# EAGLE board kulgurpower2-unrouted (EAGLE 6.3)
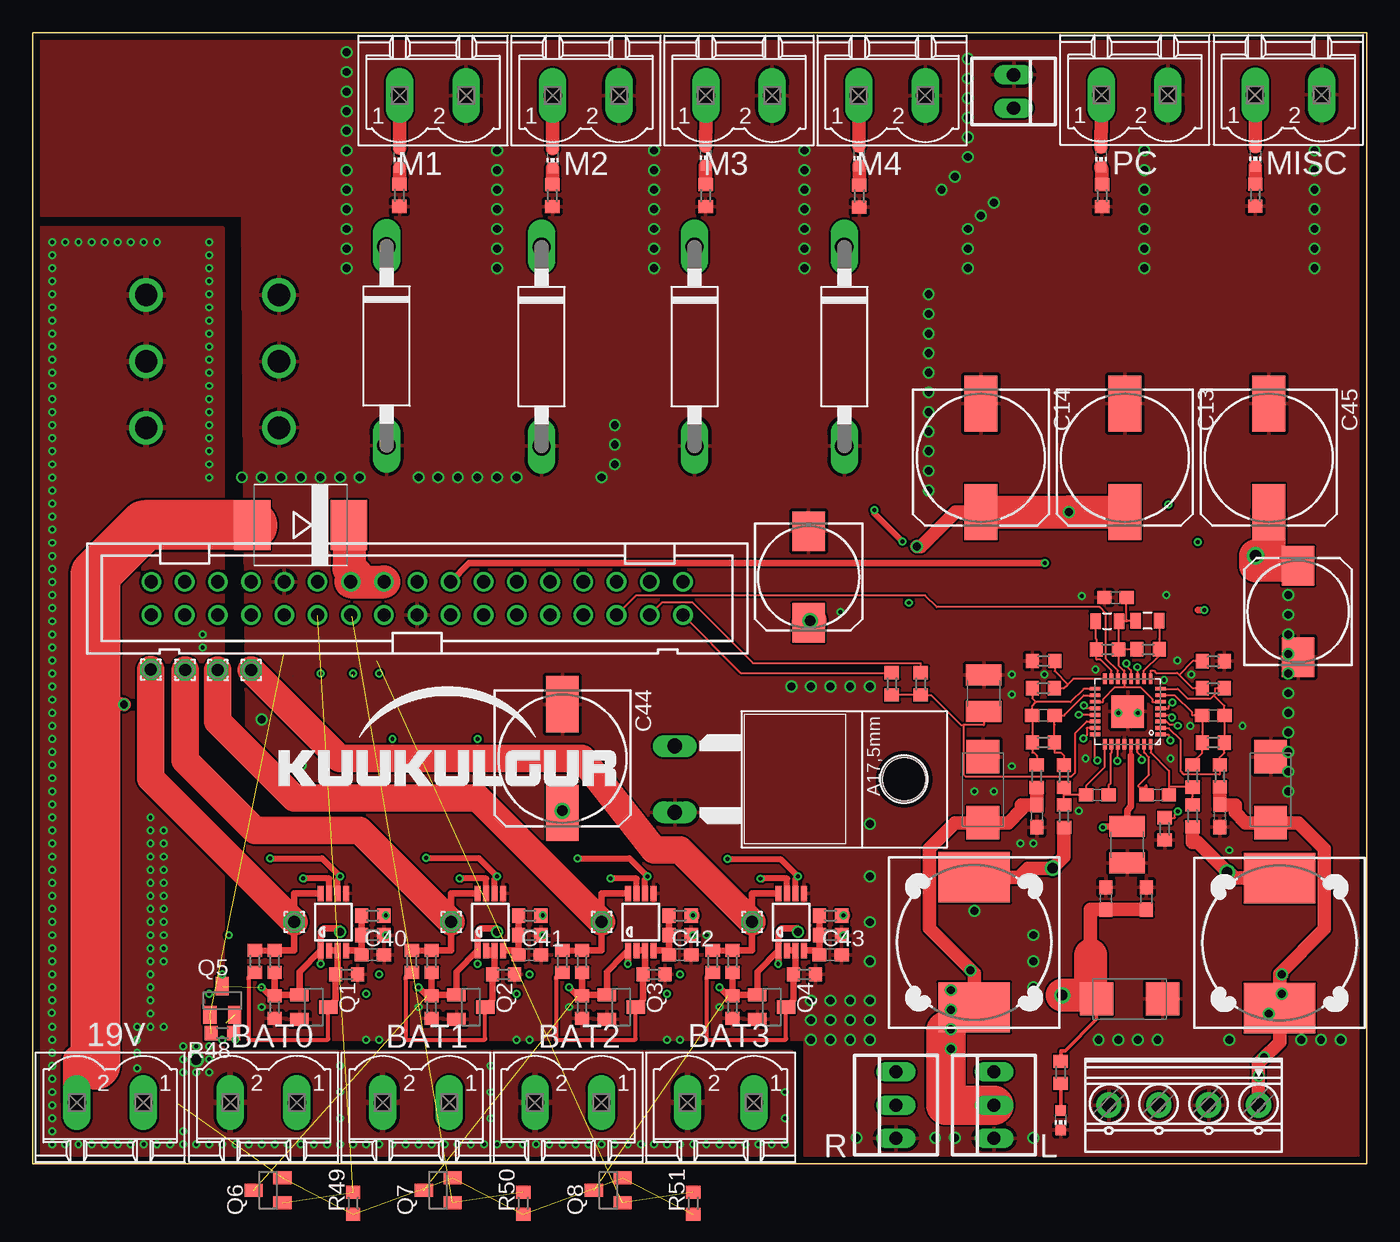
[diagram p6: board, top side]
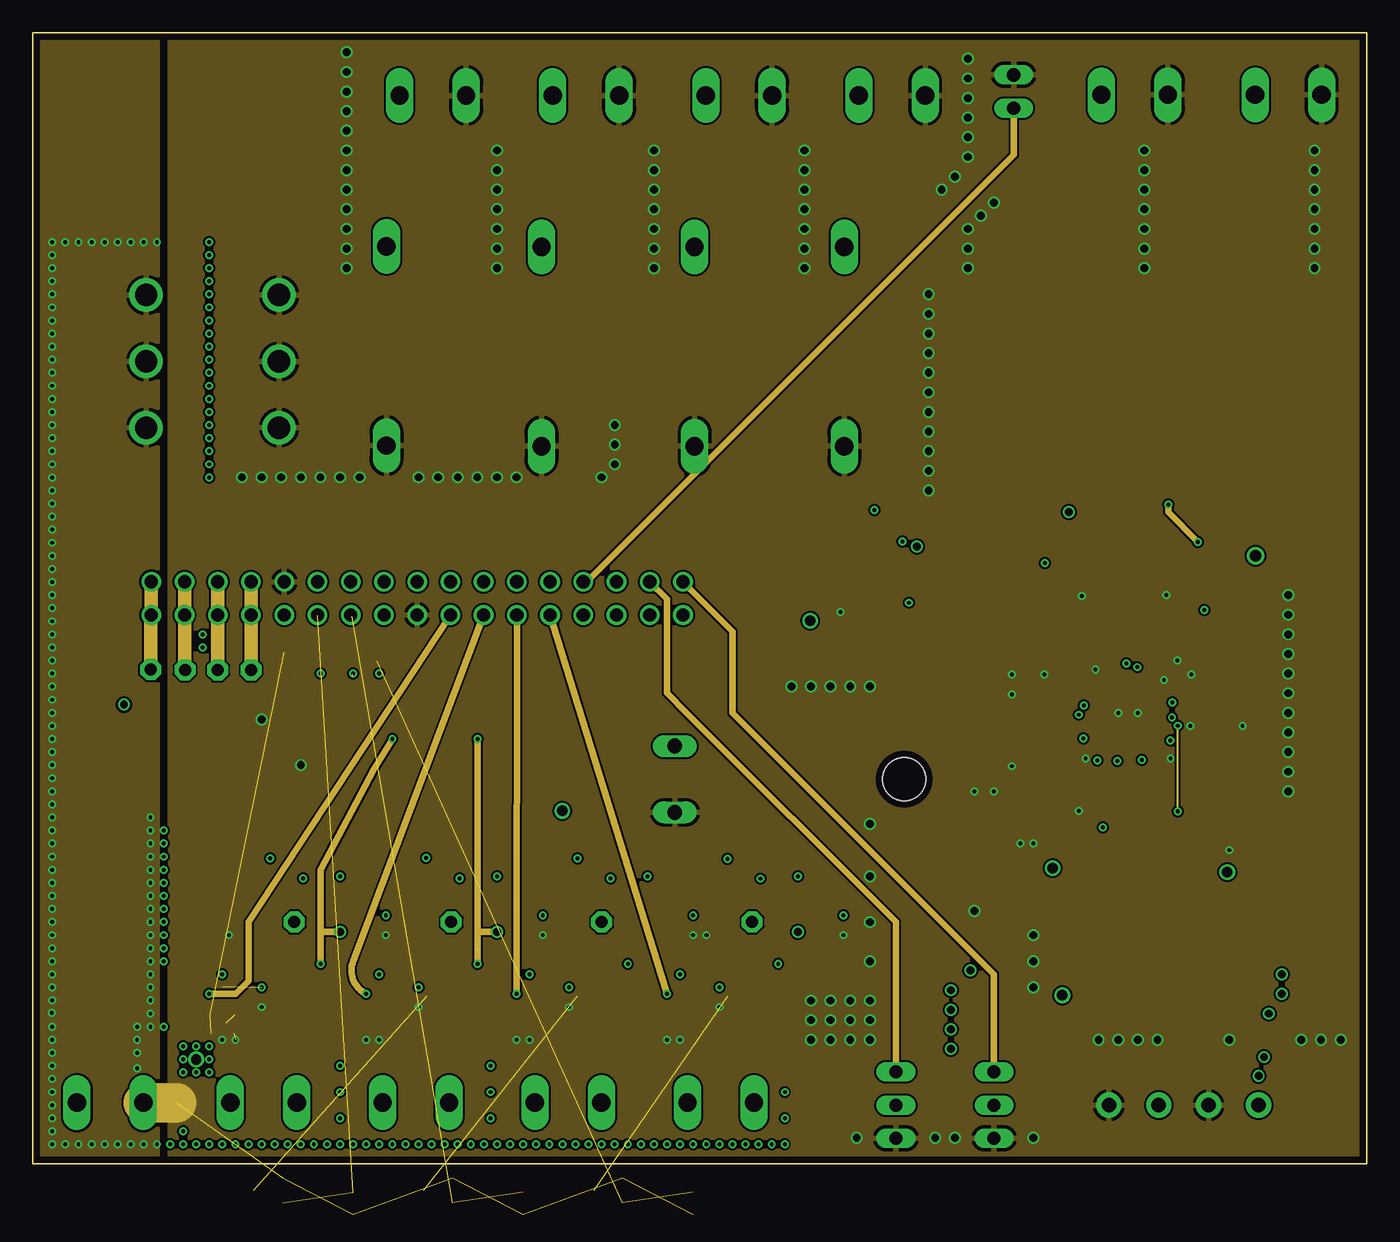
[diagram p7: board, inner layer Route2]
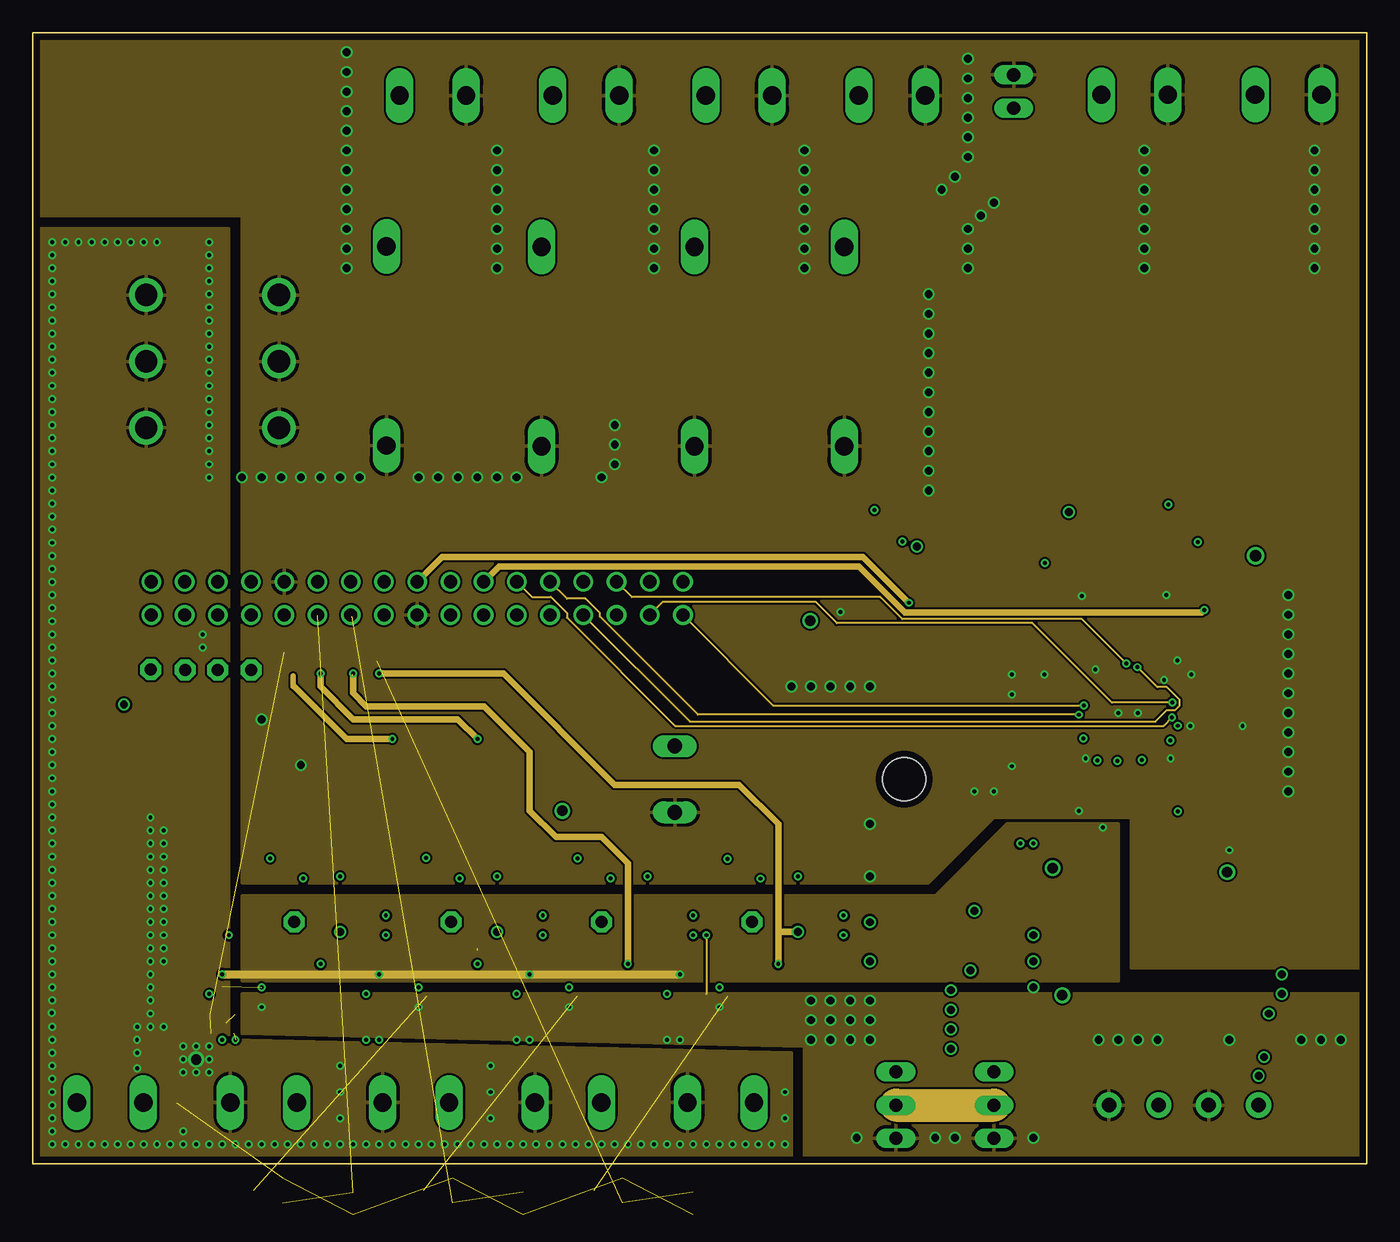
[diagram p8: board, inner layer Route15]
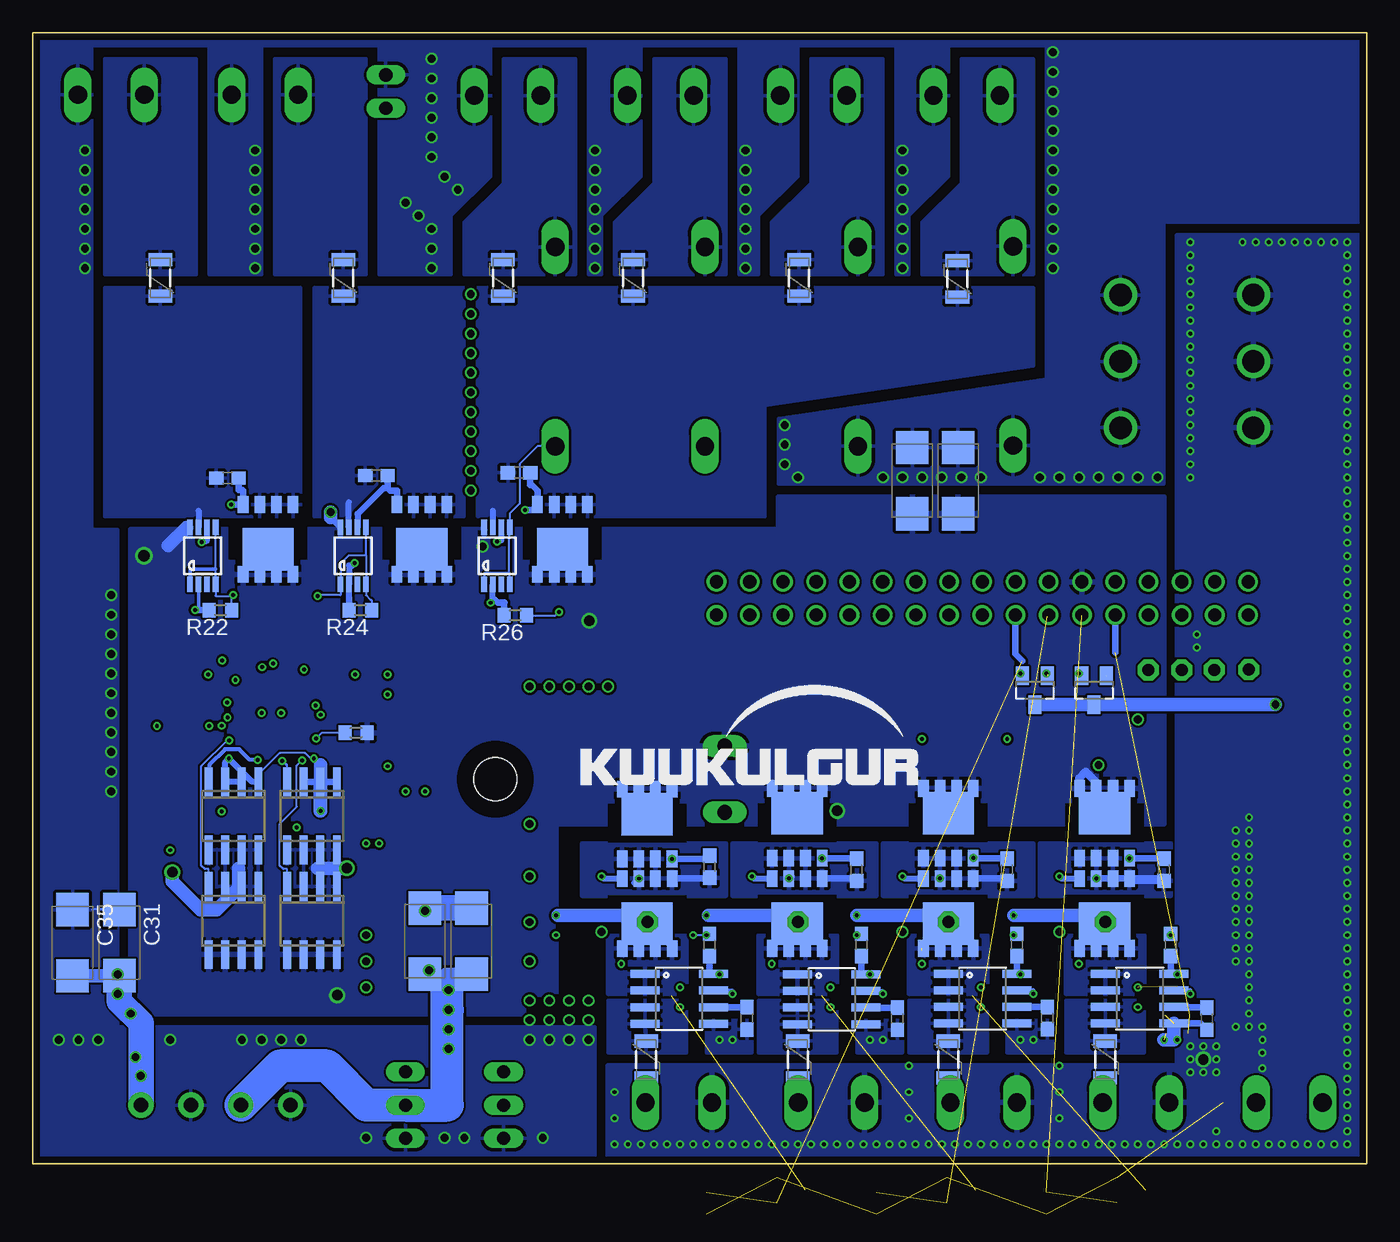
[diagram p9: board, bottom side, seen from below]

Size 102 x 86.5 mm. Coordinates in mm from the lower left corner, seen from the top.
Outline: 102,86.5 0,86.5 0,0 102,0
Outline: 102,86.5 102,0
Outline: 102,86.5 102,0
Copper layers (1*2+15*16): Top 0.035mm / dielectric 0.6mm / Route2 0.035mm / dielectric 0.15mm / Route15 0.035mm / dielectric 0.6mm / Bottom 0.035mm
Design rules "4mil_4lay2 *": minimum track width 6mil, minimum drill 0.299mm, track to track 5mil, track to pad 5mil, pad to pad 5mil, via to via 5mil, smd to smd 0mil, copper to edge 20mil, drill to drill 8mil, minimum pad ring 8mil, minimum via ring 6mil, stop-mask expansion 4mil, vias tented up to drill 18mil, thermal gap 10mil
Net classes: 0 default: width 0.152 mm, drill 0.3 mm, clearance 0.152 mm; 1 power: width 0.508 mm, drill 0.6 mm, clearance 0.178 mm; 2 morepower: width 1.016 mm, drill 0.6 mm, clearance 0.178 mm; 3 gnd: width 0.305 mm, drill 0.3 mm, clearance 0.178 mm

## Footprints (pad centres in the part's own frame; a part is rotated, then mirrored left to right if it is on the bottom)
MSTBV2 = drill 1.397 long: 1 -2.54,0; 2 2.54,0
C/6032-28R = smd 2.55 x 2.5: + 2.525,0; - -2.525,0
C0603 = smd 1.1 x 1: 1 -0.85,0; 2 0.85,0
C1210 = smd 1.6 x 2.7: 1 -1.4,0; 2 1.4,0
153CLV-1014 = smd 4.3 x 2.5: + 4.15,0; - -4.15,0
0805 = smd 0.8 x 1.2: 1 -0.9,0; 2 0.9,0
175TMP-0810 = smd 3 x 2.5: + 3.5,0; - -3.5,0
SOT23 = smd 1 x 1.4: 1 -0.95,-1.1; 2 0.95,-1.1; 3 0,1.1
C1702-15 = drill 1.397 long: A 7.62,0; C -7.62,0
SMC = smd 2.8 x 3.8: A 3.7,0; C -3.7,0
C221B1A = drill 1.118 long: A 2.54,-6.35; C -2.54,-6.35 | hole 3.302: 0,11.176
PTC-1206 = smd 1 x 1.8: 1 -1.4,0; 2 1.4,0
DR125 = smd 3.85 x 5.5: 1 -4.975,0; 2 4.975,0
CHIP-LED0603 = smd 0.8 x 0.8: A 0,-0.75; C 0,0.75
1,6/0,9 = drill 0.914 pad 1.6 octagon: 1 0,0
R0603 = smd 1 x 1.1: 1 -0.85,0; 2 0.85,0
POWER56 = smd 0.81 x 1.27: P$1 -1.905,-2.67; P$2 -0.635,-2.67; P$3 0.635,-2.67; P$4 1.905,-2.67; P$5 1.905,2.67; P$6 0.635,2.67; P$7 -0.635,2.67; P$8 -1.905,2.67 | smd 3.91 x 3.25: P$9 0,0.762
SO08 = smd 0.61 x 2.21: 1 -1.905,-2.616; 2 -0.635,-2.616; 3 0.635,-2.616; 4 1.905,-2.616; 5 1.905,2.616; 6 0.635,2.616; 7 -0.635,2.616; 8 -1.905,2.616
QFN-32 = smd 0.285 x 0.8: P$1 -1.75,-2.5; P$2 -1.25,-2.5; P$3 -0.75,-2.5; P$4 -0.25,-2.5; P$5 0.25,-2.5; P$6 0.75,-2.5; P$7 1.25,-2.5; P$8 1.75,-2.5; P$17 1.75,2.5; P$18 1.25,2.5; P$19 0.75,2.5; P$20 0.25,2.5; P$21 -0.25,2.5; P$22 -0.75,2.5; P$23 -1.25,2.5; P$24 -1.75,2.5 | smd 0.8 x 0.285: P$9 2.5,-1.75; P$10 2.5,-1.25; P$11 2.5,-0.75; P$12 2.5,-0.25; P$13 2.5,0.25; P$14 2.5,0.75; P$15 2.5,1.25; P$16 2.5,1.75; P$25 -2.5,1.75; P$26 -2.5,1.25; P$27 -2.5,0.75; P$28 -2.5,0.25; P$29 -2.5,-0.25; P$30 -2.5,-0.75; P$31 -2.5,-1.25; P$32 -2.5,-1.75 | smd 2.5 x 2.5: P$33 0,0
MAX1614EUA = smd 0.45 x 1.2: 1 -0.975,-2.175; 2 -0.325,-2.175; 3 0.325,-2.175; 4 0.975,-2.175; 5 0.975,2.175; 6 0.325,2.175; 7 -0.325,2.175; 8 -0.975,2.175
PC-6-16/2-G-10.16 = drill 1.7: P$1 -5.08,0; P$2 -5.08,-5.08; P$3 -5.08,-10.16; P$4 5.08,0; P$5 5.08,-5.08; P$6 5.08,-10.16
SO8 = smd 0.6 x 2.2: 1 -1.905,-2.6; 2 -0.635,-2.6; 3 0.635,-2.6; 4 1.905,-2.6; 5 1.905,2.6; 6 0.635,2.6; 7 -0.635,2.6; 8 -1.905,2.6
1727036 = drill 1.1 pad 1.93: 1 -5.715,0; 2 -1.905,0; 3 1.905,0; 4 5.715,0
PAK100/2500-34 = drill 1 pad 1.422: 1 -20.32,-1.27; 2 -20.32,1.27; 3 -17.78,-1.27; 4 -17.78,1.27; 5 -15.24,-1.27; 6 -15.24,1.27; 7 -12.7,-1.27; 8 -12.7,1.27; 9 -10.16,-1.27; 10 -10.16,1.27; 11 -7.62,-1.27; 12 -7.62,1.27; 13 -5.08,-1.27; 14 -5.08,1.27; 15 -2.54,-1.27; 16 -2.54,1.27; 17 0,-1.27; 18 0,1.27; 19 2.54,-1.27; 20 2.54,1.27; 21 5.08,-1.27; 22 5.08,1.27; 23 7.62,-1.27; 24 7.62,1.27; 25 10.16,-1.27; 26 10.16,1.27; 27 12.7,-1.27; 28 12.7,1.27; 29 15.24,-1.27; 30 15.24,1.27; 31 17.78,-1.27; 32 17.78,1.27; 33 20.32,-1.27; 34 20.32,1.27
22-23-2031 = drill 1 long: 1 -2.54,0; 2 0,0; 3 2.54,0
22-23-2021 = drill 1 long: 1 -1.27,0; 2 1.27,0

## Placement (x,y rotation side)
19V  MST2V  [MSTBV2]  5.92,4.69 180 top
BAT0  MST2V  [MSTBV2]  17.65,4.71 180 top
BAT1  MST2V  [MSTBV2]  29.3,4.7 180 top
BAT2  MST2V  [MSTBV2]  40.94,4.7 180 top
BAT3  MST2V  [MSTBV2]  52.6,4.7 180 top
C1  [C/6032-28R]  94.65,28.62 270 top
C2  [C/6032-28R]  72.65,28.62 270 top
C3  15V  [C/6032-28R]  83.86,12.62 180 top
C4  0.1  [C0603]  35.9,11.11 90 bottom
C5  10u  [C1210]  83.67,24.42 90 top
C6  0.1  [C0603]  39,22.5 90 bottom
C7  0.1  [C0603]  47.4,11.14 90 bottom
C8  0,1u  [C0603]  86.02,28.2 0 top
C9  0.1  [C0603]  50.24,22.73 90 bottom
C10  220n  [C0603]  82.78,43.3 180 top
C11  0.1  [C0603]  24.43,11.15 90 bottom
C12  0.1  [C0603]  27.5,22.5 90 bottom
C13  820uF/25V  [153CLV-1014]  83.5,54 270 top
C14  820uF/25V  [153CLV-1014]  72.5,54 270 top
C15  [C/6032-28R]  72.02,17.04 270 bottom
C16  0,1u  [C0603]  90.27,34.3 180 top
C17  10uF/6.3V  [C1210]  72.71,35.99 270 top
C18  0.1  [C0603]  12.22,11.11 90 bottom
C19  0.1  [C0603]  15.5,22.5 90 bottom
C20  0,1u  [C0603]  77.27,34.31 0 top
C21  0,1u  [C0603]  81.4,28.21 180 top
C22  0.1  [C0603]  75.72,52.63 0 bottom
C23  0.1  [C0603]  87.11,52.45 0 bottom
C24  0.1  [C0603]  64.81,52.85 0 bottom
C25  0.1  [C0603]  15,16.75 270 bottom
C26  0.1  [C0603]  26.75,16.75 270 bottom
C27  0.1  [C0603]  38.65,16.75 270 bottom
C28  0.1  [C0603]  50.25,16.75 270 bottom
C29  0,1u  [C0603]  85.15,20.3 270 top
C30  [C/6032-28R]  68.45,17.04 270 bottom
C31  [C/6032-28R]  95.37,16.93 270 bottom
C32  0.1  [C0603]  82.05,20.3 90 top
C33  100pF  [0805]  82.15,41.51 0 top
C34  100pF  [0805]  85.23,41.53 180 top
C35  [C/6032-28R]  98.95,16.91 270 bottom
C36  47uF/25V  [C/6032-28R]  34.75,52.25 270 bottom
C37  47uF/25V  [C/6032-28R]  31.25,52.25 270 bottom
C38  47uF/25V  [175TMP-0810]  96.75,42.25 90 top
C39  47uF/25V  [175TMP-0810]  59.32,44.88 270 top
C40  100nF  [C0603]  26,16 0 top
C41  100nF  [C0603]  38,16 0 top
C42  100nF  [C0603]  49.5,16 0 top
C43  100nF  [C0603]  61,16 0 top
C44  820uF/25V  [153CLV-1014]  40.5,31 270 top
C45  820uF/25V  [153CLV-1014]  94.5,54 270 top
C104  0.1  [C0603]  76.77,26.6 270 top
C113  0.1  [C0603]  90.75,26.61 270 top
D1  BAT54C  [SOT23]  20.85,36.22 180 bottom
D2  1N5351BGOS  [C1702-15]  27.05,62.55 270 top
D3  BAT54C  [SOT23]  25.38,36.22 180 bottom
D4  MBRS330T3  [SMC]  20.49,48.85 180 top
D20  STPS15L25D  [C221B1A]  55.44,29.42 270 top
D21  1N5351BGOS  [C1702-15]  38.9,62.5 270 top
D22  1N5351BGOS  [C1702-15]  50.6,62.5 270 top
D23  1N5351BGOS  [C1702-15]  62.05,62.5 270 top
F1  10A FUSE 1206  [PTC-1206]  78.25,67.75 90 bottom
F2  10A FUSE 1206  [PTC-1206]  92.25,67.75 90 bottom
F3  15A FUSE 1206  [PTC-1206]  20,8 270 bottom
F4  15A FUSE 1206  [PTC-1206]  32,8 270 bottom
F5  15A FUSE 1206  [PTC-1206]  43.5,8 270 bottom
F6  15A FUSE 1206  [PTC-1206]  55.1,8 270 bottom
F7  10A FUSE 1206  [PTC-1206]  31.3,67.67 90 bottom
F8  10A FUSE 1206  [PTC-1206]  43.4,67.75 90 bottom
F9  10A FUSE 1206  [PTC-1206]  56.1,67.75 90 bottom
F10  10A FUSE 1206  [PTC-1206]  66.05,67.75 90 bottom
L1  4,7uH  [DR125]  95.33,16.89 90 top
L2  4,7uH  [DR125]  71.98,16.95 270 top
LED1  BLUE  [CHIP-LED0603]  28.04,76.93 180 top
LED2  BLUE  [CHIP-LED0603]  39.76,76.89 180 top
LED3  BLUE  [CHIP-LED0603]  51.46,77.08 180 top
LED4  BLUE  [CHIP-LED0603]  63.19,77.07 180 top
LED5  BLUE  [CHIP-LED0603]  81.68,76.99 180 top
LED6  BLUE  [CHIP-LED0603]  93.48,77.03 180 top
M1  MST2V  [MSTBV2]  30.6,81.7 0 top
M2  MST2V  [MSTBV2]  42.3,81.7 0 top
M3  MST2V  [MSTBV2]  54,81.7 0 top
M4  MST2V  [MSTBV2]  65.7,81.7 0 top
MISC  MST2V  [MSTBV2]  96,81.75 0 top
PAD1  [1,6/0,9]  20,18.5 0 top
PAD2  [1,6/0,9]  32,18.5 0 top
PAD3  [1,6/0,9]  43.5,18.5 0 top
PAD4  [1,6/0,9]  55,18.5 0 top
PAD5  [1,6/0,9]  16.7,37.77 0 top
PAD6  [1,6/0,9]  14.15,37.77 0 top
PAD7  [1,6/0,9]  11.64,37.78 0 top
PAD8  [1,6/0,9]  9.04,37.8 0 top
PC  MST2V  [MSTBV2]  84.25,81.75 0 top
PWRLED  BLUE  [CHIP-LED0603]  78.59,3.35 180 top
Q1  IRLML6344TRPbF  [SOT23]  21.5,12 270 top
Q2  IRLML6344TRPbF  [SOT23]  33.5,12 270 top
Q3  IRLML6344TRPbF  [SOT23]  45,12 270 top
Q4  IRLML6344TRPbF  [SOT23]  56.5,12 270 top
Q5  IRLML6344TRPbF  [SOT23]  14.5,12.5 0 top
Q6  IRLML6344TRPbF  [SOT23]  18,-2 90 top
Q7  IRLML6344TRPbF  [SOT23]  31,-2 90 top
Q8  IRLML6344TRPbF  [SOT23]  44,-2 90 top
R1  3k  [R0603]  81.75,74.03 90 top
R2  3k  [R0603]  93.47,74.07 90 top
R3  270k  [R0603]  86.54,25.63 90 top
R4  30k  [R0603]  90.27,38.44 180 top
R5  30k  [R0603]  77.29,38.46 0 top
R6  3k  [R0603]  28.04,74.07 90 top
R7  3k  [R0603]  39.73,74.03 90 top
R8  3k  [R0603]  51.46,74.03 90 top
R9  3k  [R0603]  63.2,74 90 top
R10  430k  [R0603]  67.9,36.71 90 top
R11  680k  [R0603]  26,19 0 top
R12  3k  [R0603]  78.59,7.01 90 top
R13  100k  [R0603]  26,17.5 180 top
R14  430k  [R0603]  65.69,36.71 90 top
R15  680k  [R0603]  38,19 0 top
R16  100k  [R0603]  38,17.5 180 top
R17  680k  [R0603]  49.5,19 0 top
R18  100k  [R0603]  49.5,17.5 180 top
R19  680k  [R0603]  61,19 0 top
R20  100k  [R0603]  61,17.5 180 top
R21  120k  [R0603]  90.27,36.37 0 top
R22  10k  [R0603]  87.65,42.35 180 bottom
R23  18k  [R0603]  85.27,39.35 180 top
R24  10k  [R0603]  76.95,42.35 180 bottom
R25  3k12  [R0603]  90.26,32.23 0 top
R26  10k  [R0603]  65.1,41.95 180 bottom
R27  430k  [R0603]  17,15.5 90 top
R28  100k  [R0603]  24,14.5 180 top
R29  DNM  [R0603]  18.5,12 90 top
R30  430k  [R0603]  18.5,15.5 90 top
R31  10k  [R0603]  88.69,29.66 270 top
R32  10k  [R0603]  78.84,29.64 270 top
R33  3k12  [R0603]  77.27,32.23 0 top
R34  430k  [R0603]  29,15.5 90 top
R35  100k  [R0603]  36,14.5 180 top
R36  DNM  [R0603]  30.5,12 90 top
R37  430k  [R0603]  30.5,15.5 90 top
R38  430k  [R0603]  40.5,15.5 90 top
R39  30k  [R0603]  82.18,39.34 180 top
R40  180k  [R0603]  77.27,36.38 180 top
R41  100k  [R0603]  47.5,14.5 180 top
R42  DNM  [R0603]  42,12 90 top
R43  430k  [R0603]  42,15.5 90 top
R44  430k  [R0603]  52,15.5 90 top
R45  100k  [R0603]  59,14.5 180 top
R46  DNM  [R0603]  53.5,12 90 top
R47  430k  [R0603]  53.5,15.5 90 top
R48  100k  [R0603]  14.5,10 180 top
R49  100k  [R0603]  24.5,-3 90 top
R50  100k  [R0603]  37.5,-3 90 top
R51  100k  [R0603]  50.5,-3 90 top
SJ100  0R  [R0603]  76.76,29.66 270 top
SJ104  0R  [R0603]  77.28,32.97 0 bottom
SJ108  0R  [R0603]  88.67,26.61 270 top
SJ110  0R  [R0603]  78.84,26.6 270 top
SJ114  0R  [R0603]  90.76,29.67 270 top
U$1  AON6500  [POWER56]  61.5,47.76 180 bottom
U$2  AON6500  [POWER56]  55.02,26 0 bottom
U$3  AON6500  [POWER56]  55.02,19.15 180 bottom
U$4  ACS712  [SO08]  52.58,12.63 270 bottom
U$5  AON6500  [POWER56]  20.05,26.05 0 bottom
U$6  AON6500  [POWER56]  43.55,26.05 0 bottom
U$7  AON6500  [POWER56]  43.55,19.16 180 bottom
U$8  ACS712  [SO08]  40.9,12.6 270 bottom
U$9  AON6500  [POWER56]  32,26.05 0 bottom
U$10  AON6500  [POWER56]  32,19.16 180 bottom
U$11  ACS712  [SO08]  29.38,12.65 270 bottom
U$12  AON6500  [POWER56]  20.05,19.16 180 bottom
U$13  ACS712  [SO08]  17.36,12.65 270 bottom
U$14  AON6500  [POWER56]  72.25,47.75 180 bottom
U$15  AON6500  [POWER56]  84,47.75 180 bottom
U$17  TPS51222RTVT  [QFN-32]  83.72,34.59 90 top
U$20  MAX1614EUA  [MAX1614EUA]  23,18.5 0 top
U$21  MAX1614EUA  [MAX1614EUA]  46.5,18.5 0 top
U$22  MAX1614EUA  [MAX1614EUA]  35,18.5 0 top
U$23  MAX1614EUA  [MAX1614EUA]  58,18.5 0 top
U$24  MAX1614EUA  [MAX1614EUA]  66.5,46.5 0 bottom
U$25  MAX1614EUA  [MAX1614EUA]  77.5,46.5 0 bottom
U$26  MAX1614EUA  [MAX1614EUA]  89,46.5 0 bottom
U$27  PC-6-16/2-G-10.16-1913646  [PC-6-16/2-G-10.16]  13.75,56.29 180 top
U$105  IRF8252  [SO8]  86.65,18.62 180 bottom
U$106  IRF8252  [SO8]  86.65,26.62 180 bottom
U$107  IRF8252  [SO8]  80.65,26.62 180 bottom
U$108  IRF8252  [SO8]  80.65,18.62 180 bottom
X1  1727036  [1727036]  88,4.5 180 top
X2  2534-  [PAK100/2500-34]  29.4,43.25 0 top
X3  22-23-2031  [22-23-2031]  73.5,4.5 90 top
X4  22-23-2031  [22-23-2031]  66,4.5 90 top
X5  22-23-2021  [22-23-2021]  75,82 270 top

## Tracks (layer width: path | path; a pad name or v marks a point on that pad's centre or on a via)
5V_LDO  (via drill 0.3 pad 0.6)
  Top 0.284: 83.97,31.26 U$17.P$29
  Top 0.508: 83.97,31.26 83.97,27.35 83.67,27.05 C5.2 81.89,25.82 v81.81,25.74
  Route15 0.508: v26.5,14.5 v38,14.5
  Route15 0.61: v14.5,14.5 v26.5,14.5 v38,14.5 v49.5,14.5
  Bottom 0.3: C26.2 26.75,14.75 v26.5,14.5
  Bottom 0.45: C26.2 arc-90 26.76,15.89 U$11.8
  Bottom 0.508: U$13.8 15,14.81 C25.2 | 27.25,14.55 U$11.8 26.55,14.55 v26.5,14.5 | C27.2 38.65,14.5 U$8.8 v38,14.5 | C28.2 50.25,14.54 U$4.8 49.54,14.54 v49.5,14.5 | U$13.8 14.55,14.55 | 14.55,14.55 v14.5,14.5 | 26.76,15.89 26.76,14.76 v26.5,14.5 | U$13.8 14.55,14.55 | 14.55,14.55 v14.5,14.5 | v14.5,14.5 15.5,14.5 | v26.5,14.5 26,14.5
  pour Route15: 16,14 83,14 83,26 74.5,26 69,20.5 16,20.5
!BAT0_EN  (via drill 0.3 pad 0.6, 0.6)  (2 unrouted)
  Top 0.406: U$20.1 22,16.32 v22,15.3
  Top 0.45: R29.2 18.15,12.85 v17.5,13.5
  Top 0.508: R30.1 R29.2 18.6,12.95 Q1.1 20.4,14.7 U$20.1 | 22.02,15.32 v22,15.3 | 22,16.5 22,17.75 22.25,18 23.5,18 v23.5,17.75
  Route2 0.508: v22,15.3 22,17.75 | 22,17.75 22,20.5 22,22.5 26.09,30.22 v27.5,32.5 | v23.5,17.75 22.25,17.75 22,17.75
  Route15 0.406: 20,36.5 19.9,36.5 D1.1
  Route15 0.508: 20,36.5 24,32.5 24.68,32.5 v27.5,32.5
  Bottom 0.508: 19.9,37.4 D1.1 19.9,37.4 | 19.9,37.4 20,37.5 19.9,37.4
!BAT1_EN  (via drill 0.3 pad 0.6, 0.6)  (2 unrouted)
  Top 0.45: R36.2 30.15,12.85 v29.5,13.5
  Top 0.508: R37.1 R36.2 30.6,12.95 Q2.1 32.4,14.7 U$22.1 | 34.02,15.32 v34,15.3 | 34,16.5 34,17.75 34.25,18 35.5,18 v35.5,17.75
  Route2 0.508: v34,15.3 34,17.75 | 34,17.75 34,19.5 34,30 | 34,30 v34,32.5 34,30 | v35.5,17.75 34.25,17.75 34,17.75
  Route15 0.508: v22,37.5 22,36.5 24.5,34 32.5,34 v34,32.5
  Bottom 0.508: D1.2 21.82,37.32 v22,37.5
!BAT2_EN  (via drill 0.3 pad 0.6)  (2 unrouted)
  Top 0.45: R42.2 41.65,12.85 v41,13.5
  Top 0.508: R43.1 R42.2 42.1,12.95 Q3.1 43.9,14.7 45.1,15.9 U$21.1 45.52,15.32 v45.5,15.3
  Route15 0.508: v24.5,37.5 24.5,36 25.5,35 34.5,35 38,31.5 38,27 40,25 43.5,25 45.5,23 v45.5,15.3 | v45.5,15.3 45.5,16.3 | 45.5,16.3 U$21.1 45.5,16.3 | 45.52,15.53 v45.5,15.3 | 45.52,15.53 v45.5,15.3 | 45.52,15.53 v45.5,15.3 | v45.5,15.3 45.5,16.3
  Bottom 0.508: 24.43,37.43 v24.5,37.5 24.43,37.43
!BAT3_EN  (via drill 0.3 pad 0.6, 0.6)  (2 unrouted)
  Top 0.45: R46.2 53.15,12.85 v52.5,13.5
  Top 0.508: R47.1 R46.2 53.6,12.95 Q4.1 55.4,14.7 U$23.1 | U$23.1 57.02,15.32 | 57.02,15.32 v57,15.3 | 57.02,15.32 v57,15.3 | 57.02,15.32 v57,15.3 | v58.5,17.75 58.5,18 57.25,18 57,17.75 57,16.5 U$23.1
  Route15 0.508: v26.5,37.5 36,37.5 44.5,29 54,29 57,26 57,17.75 | 57,17.75 v57,15.3 | v58.5,17.75 57.25,17.75 57,17.75
  Bottom 0.508: 26.33,37.33 v26.5,37.5
!OFF_0
  Top 0.3: R27.1 arc90 16.5,14.15 16.5,9.5 22.5,9.5 arc90 22.6,9.6 Q1.3
  Top 0.508: U$20.2 U$20.3 23.32,14.68 R28.2 23.15,12.55 Q1.3
!OFF_1
  Top 0.3: R34.1 arc90 28.5,14.15 28.5,9.5 34.5,9.5 arc90 34.6,9.6 Q2.3
  Top 0.508: 35,16 34.67,16 U$22.2 U$22.3 35.33,14.68 R35.2 35.15,12.55 Q2.3
!OFF_2
  Top 0.3: R38.1 arc90 40,14.15 40,9.5 46,9.5 arc90 46.1,9.6 Q3.3
  Top 0.508: Q3.3 46.65,12.55 R41.2 46.83,14.18 U$21.3 U$21.2
!OFF_3
  Top 0.3: R44.1 arc90 51.5,14.15 51.5,9.5 57.5,9.5 arc90 57.6,9.6 Q4.3
  Top 0.508: Q4.3 58.15,12.55 R45.2 58.33,14.18 U$23.3 U$23.2
+5V  (via drill 0.6 pad 0.6)
  Top 0.61: v93.73,6.73 93.73,7.76 | 93.73,7.76 v94.14,8.18 | 93.73,7.76 93.78,7.76 94.01,7.99 | v94.5,11.5 94.91,11.5 L1.1 | v95.5,13 95.37,13 | v95.5,14.5 95.47,14.5 C31.+
  Top 1.016: L1.1 95.33,14.5 | 95.33,14.5 95.33,14.53 98.77,17.97 98.77,24.09 96.76,26.09 C1.+ 92.71,26.09 91.93,26.87 91.93,27.46 C113.1 90.76,27.48 SJ114.2 | X1.1 93.72,7.69 94.01,7.99 95.33,9.31 L1.1 | v95.5,13 L1.1 | v95.5,14.5 95.33,14.5
  Bottom 1.016: C35.+ 97.32,14.39 97.31,14.4 C31.+
  Bottom 1.93: X1.1 93.72,10.79 95.37,12.44 C31.+
+19V  (via drill 0.6 pad 0.6)
  Top 1.016: v6.98,35.13 5.98,35.33 4.5,35.33 4.8,34.83
  Top 2.095: 4.8,8.02 3.38,8.02 19V.2
  Top 3.81: D4.A 8.56,48.85 4.8,45.09 4.8,30.5 | 4.8,34.83 4.8,30.5 | 4.8,30.5 4.8,8.02 4.8,7.6
  Bottom 1.016: v6.98,35.13 v6.99,35.12 D1.3 22.04,35.12 D3.3
+19V_CHG
  Top 2.54: D4.C 24.18,45.53 24.29,45.53 25.3,44.52 | 25.3,44.52 X2.16 | X2.14 25.3,44.52
BAT0_EN  (2 unrouted)
  Bottom 0.508: 19.23,39.12 X2.9
BAT0_G  (via drill 0.3 pad 0.6)
  Top 0.45: U$20.6 23.32,21.82 v23.5,22 22.13,23.37 v18.15,23.37
  Bottom 0.45: v23.5,22 23.33,21.83 U$12.P$4
  Bottom 0.508: C19.2 15.5,23.38 U$5.P$4 18.25,23.5 v18.15,23.37
BAT0_S  (via drill 0.3 pad 0.6)
  Top 0.45: U$20.7 22.68,21.83 20.75,21.83 U$12.P$3
  Top 0.508: 20.75,21.83 20.75,21.75 v20.69,21.83
  Bottom 0.45: U$12.P$3 19.67,21.83 arc-90 19.5,22
  Bottom 0.508: C19.1 18.14,21.65 U$12.P$1 | U$12.P$3 20.5,22 | U$12.P$3 18.17,21.83 18,22 | U$12.P$3 15.83,21.83 15.5,21.5
  pour Bottom: 15,24.5 25,24.5 25,20.5 15,20.5
BAT1_EN  (2 unrouted)
  Bottom 0.508: X2.11 21.8,41.95
BAT1_G  (via drill 0.3 pad 0.6)
  Top 0.45: U$22.6 35.33,21.82 v35.5,22 34.1,23.4 v30.07,23.4
  Bottom 0.45: v35.5,22 35.33,21.83 U$10.P$4
  Bottom 0.508: C12.2 27.5,23.38 U$9.P$4 30,23.5 v30.07,23.4
BAT1_S  (via drill 0.3 pad 0.6)
  Top 0.45: U$22.7 34.67,21.83 32.75,21.83 U$10.P$3
  Top 0.508: 32.75,21.83 32.75,21.75 U$10.P$3
  Bottom 0.508: U$10.P$1 27.5,21.83 C12.1 | U$10.P$3 32.63,21.87 32.5,22
  other vias: 32.63,21.83
  pour Bottom: 25.5,24.5 37,24.5 37,20.5 25.5,20.5
BAT2_EN  (2 unrouted)
  Bottom 0.508: X2.13 24.43,41.86
BAT2_G  (via drill 0.3 pad 0.6)
  Top 0.45: U$21.6 46.83,21.82 v47,22 45.62,23.38 U$6.P$4 | U$6.P$4 | U$6.P$4 41.64,23.38 U$6.P$4 | U$6.P$4 | U$6.P$4 | U$6.P$4 | U$6.P$4
  Bottom 0.45: v47,22 46.83,21.83 U$7.P$4 | U$6.P$4 39,23.38 39,23.5
  Bottom 0.508: U$6.P$4 39,23.38 C6.2 | U$6.P$4 | U$6.P$4
  other vias: 41.65,23.38
BAT2_S  (via drill 0.3 pad 0.6)
  Top 0.45: U$21.7 46.17,21.83 44.25,21.83 U$7.P$3
  Top 0.508: 44.25,21.83 44.25,21.75 U$7.P$3
  Bottom 0.508: U$7.P$1 39,21.83 C6.1 | U$7.P$3 44.17,21.83 44,22
  other vias: 44.19,21.83
  pour Bottom: 37.5,24.5 48.5,24.5 48.5,20.5 37.5,20.5
BAT3_EN  (2 unrouted)
  Bottom 0.508: X2.15 26.86,38.98 26.33,38.46
BAT3_G  (via drill 0.3 pad 0.6)
  Top 0.45: U$23.6 58.33,21.82 v58.5,22 57.17,23.33 U$2.P$4
  Bottom 0.45: v58.5,22 58.32,21.82 U$3.P$4 | U$2.P$4
  Bottom 0.508: U$2.P$4 50.24,23.33 C9.2
  other vias: 53.12,23.33
BAT3_S  (via drill 0.3 pad 0.6)
  Top 0.45: U$23.7 57.67,21.82 55.75,21.82 U$3.P$3
  Top 0.508: 55.75,21.82 55.75,21.75 U$3.P$3
  Bottom 0.508: U$3.P$1 50.24,21.82 C9.1 | U$3.P$3 55.68,21.82 56,21.5
  other vias: 55.66,21.82
  pour Bottom: 49,24.5 60,24.5 60,20.5 49,20.5
BAT-  (via drill 0.3 pad 0.6, 0.8 pad 0.6)
  other vias: 1.5,1.5 2.5,1.5 3.5,1.5 4.5,1.5 5.5,1.5 6.5,1.5 7.5,1.5 8.5,1.5 9.5,1.5 10.5,1.5 11.5,1.5 12.5,1.5 13.5,1.5 14.5,1.5 15.5,1.5 16.5,1.5 17.5,1.5 18.5,1.5 19.5,1.5 20.5,1.5 21.5,1.5 22.5,1.5 23.5,1.5 24.5,1.5 25.5,1.5 26.5,1.5 27.5,1.5 28.5,1.5 29.5,1.5 30.5,1.5 31.5,1.5 32.5,1.5 33.5,1.5 34.5,1.5 35.5,1.5 36.5,1.5 37.5,1.5 38.5,1.5 39.5,1.5 40.5,1.5 41.5,1.5 42.5,1.5 43.5,1.5 44.5,1.5 45.5,1.5 46.5,1.5 47.5,1.5 48.5,1.5 49.5,1.5 50.5,1.5 51.5,1.5 52.5,1.5 53.5,1.5 54.5,1.5 55.5,1.5 56.5,1.5 57.5,1.5 1.5,6.5 1.5,7.5 1.45,11.55 1.5,12.5 1.5,13.5 1.5,14.5 1.5,15.5 1.5,16.5 1.5,17.5 1.5,18.5 1.5,19.5 1.5,20.5 1.5,21.5 1.5,22.5 1.5,23.5 1.5,24.5 1.5,25.5 1.5,26.5 1.5,27.5 1.5,28.5 1.5,29.5 1.5,30.5 1.5,39.5 1.5,40.5 1.5,41.5 1.5,42.5 1.5,43.5 1.5,44.5 1.5,45.5 1.5,46.5 1.5,47.5 1.5,48.5 1.5,49.5 1.5,50.5 1.5,51.5 1.5,52.5 1.5,53.5 1.5,54.5 1.5,55.5 1.5,56.5 1.5,57.5 1.5,58.5 1.5,59.5 1.5,60.5 1.5,61.5 1.5,62.5 1.5,63.5 1.5,64.5 1.5,65.5 1.5,66.5 1.5,67.5 1.5,68.5 1.5,69.5 1.5,70.5 2.5,70.5 3.5,70.5 4.5,70.5 5.5,70.5 6.5,70.5 7.5,70.5 8.5,70.5 9.5,70.5 13.5,70.5 57.5,3.5 57.5,5.5 7.98,7.3 7.98,8.5 7.97,9.5 9,10.5 9,11.5 9,12.5 9,13.5 9,14.5 11.5,2.5 11.5,7 10,10.5 8,10.5 9,15.5 9,16.5 9,17.5 9,18.5 9,19.5 10,19.5 10,18.5 10,17.5 10,16.5 10,15.5 13.5,69.5 13.5,68.5 13.5,67.5 13.5,66.5 13.5,65.5 13.5,64.5 13.5,63.5 13.5,62.5 13.5,61.5 13.5,60.5 13.5,59.5 13.5,58.5 13.5,57.5 13.5,56.5 13.5,55.5 13.5,54.5 13.5,53.5 13.5,52.5 13,39.5 13,40.5 23.5,3.5 23.5,5.5 23.5,7.5 35,3.5 35,5.5 35,7.5 1.5,31.5 1.5,32.5 1.5,33.5 1.5,34.5 1.5,35.5 1.5,36.5 1.5,37.5 1.5,38.5 1.5,8.5 1.5,9.5 1.5,10.5 1.5,5.5 1.5,4.5 1.5,3.5 1.5,2.5 9,20.5 9,21.5 9,22.5 9,23.5 9,24.5 9,25.5 9,26.5 10,20.5 10,21.5 10,22.5 10,23.5 10,24.5 10,25.5 11.5,9 12.5,9 13.5,9 13.5,8 12.5,8 11.5,8 12.5,7 13.5,7
  pour Top: 0,71.5 14.5,71.5 14.5,8.5 58,8.5 58,0 0,0
  pour Bottom: 58,0 0,0 0,71 14.5,71 14.5,7.5 58,7.5
  pour Route2: 0,0 9.5,0 9.5,86.5 0,86.5
  pour Route15: 0,71.5 15,71.5 15,9.5 58,8.5 58,0 0,0
COMP1
  Top 0.152: U$17.P$10 84.97,37.72 86.12,38.87 R23.1 86.12,40.12 86.13,40.13 C34.1
COMP2
  Top 0.152: U$17.P$15 82.47,37.72 81.62,38.56 81.33,38.56 R39.2 81.33,40.12 81.25,40.2 C33.1
COMPUTER_PWR
  Route2 0.508: X5.2 75,77.16 42.35,44.52 X2.28
CSN1
  Top 0.152: R21.2 90.39,36.37 90.39,35.91 90.31,35.84 | 90.31,35.84 91.12,35.03 C16.1 91.12,33.01 91.11,33.01 R25.2 91.11,31.45 90.76,31.09 SJ114.1 90.76,29.79 90.75,29.79 88.02,29.79 87.76,30.04 87.76,32.43 86.87,33.31 86.25,33.31 U$17.P$2 | U$17.P$8 87.55,36.34 88.3,35.59 90.07,35.59 90.31,35.84
CSN2
  Top 0.152: U$17.P$17 80.36,36.34 79.34,35.32 76.71,35.32 | R40.2 76.42,35.6 76.71,35.32 | 76.71,35.32 76.42,35.04 C20.1 76.42,33.01 R33.1 76.42,31.45 76.55,31.45 76.76,31.23 SJ100.1
CSP1
  Top 0.152: R31.1 88.69,30.72 89.41,31.45 R25.1 89.41,33.01 89.42,33.01 C16.2 88.64,34.3 88.64,34.52 87.32,35.84 U$17.P$7
CSP2
  Top 0.152: U$17.P$18 80.36,35.84 78.9,34.38 78.9,34.31 C20.2 78.12,33.58 R33.2 78.12,31.45 78.61,31.45 78.84,31.22 R32.1
DRVH1  (via drill 0.3 pad 0.6)
  Top 0.152: U$17.P$1 86.85,32.84 86.85,32.54 v86.99,32.4
  Bottom 0.152: U$105.4 88.55,22.55 88.85,22.55 89.11,22.81 89.11,30.43 87.14,32.4 v86.99,32.4
DRVH2  (via drill 0.3 pad 0.6)
  Top 0.152: v81.41,30.87 81.22,31.05 U$17.P$24
  Bottom 0.152: U$108.4 82.55,22.55 82.85,22.55 83.11,22.8 83.11,26.01 81.81,27.3 81.81,30.46 v81.41,30.87
DRVL1  (via drill 0.3 pad 0.6)
  Top 0.152: v84.8,30.9 84.8,31.15 84.47,31.48 U$17.P$30
  Bottom 0.152: 88.5,29.5 88.75,29.5 88.75,29.25 U$106.4
  Bottom 0.3: v84.8,30.9 85.4,30.9 86.2,31.7 87.3,31.7 88.5,30.5 88.5,29.5
DRVL2  (via drill 0.3 pad 0.6)
  Top 0.152: v82.91,30.83 82.97,30.89 U$17.P$27
  Bottom 0.152: U$107.4 82.55,30.55 82.63,30.55 v82.91,30.83
ENABLE_PWR  (via drill 0.3 pad 0.6)
  Top 0.152: v83.62,38.27 83.62,38.09 83.97,37.74 U$17.P$12
  Route15 0.152: v83.62,38.27 80.22,41.67 66.48,41.67 64.81,43.34 45.81,43.34 X2.30
GND  (via drill 0.3, 0.3 pad 0.6, 0.6 pad 0.6, 0.6 pad 0.9)  (8 unrouted)
  Top 0.508: R18.1 C28.1 50.4,17.6 v50.5,17.5
  Route2 3: 19V.1 11,4.7
  Route15 0.152: v51.5,17.5 51.5,13
  Bottom 0.152: 86.67,43.5 v86.69,43.51 86.8,43.39 | 76.53,46.54 77.83,46.54 78.47,45.9 U$25.1 78.47,43.5 80.15,43.5 v80.21,43.44 | R24.1 76.1,43.13 76.16,43.13 76.53,43.5 U$25.4 76.53,46.54 | 97.46,19.45 C31.- 94.63,19.45 | 86.8,43.39 87.97,43.39 88.03,43.45 U$26.4 88.03,45.5 U$26.5 | R22.1 86.8,43.39 | R26.1 62.03,41.95 v61.76,42.22 | D23.A 63.41,54.88 64.77,53.52 64.77,50.49 65.53,49.73 U$24.5 65.53,47.85 65.56,47.81 65.56,45.19 | U$24.4 65.53,45.15 65.56,45.19 | 65.56,45.19 67.44,45.19 67.47,45.15 U$24.1 | 76.53,46.54 U$25.5 | 79.71,29.55 80.01,30.24 | U$107.2 80.01,30.24 | 80.01,30.24 81.19,31.41 83.11,31.41 84.74,29.78 U$106.1 | v15,17.5 C25.1 | v51.5,17.5 v50.5,17.5 C28.1 | v27,17.5 C26.1 | v39,17.5 C27.1
  Bottom 0.254: C15.- 72.02,19.38 v71.99,19.36
  Bottom 0.284: U$26.1 89.97,45.5 88.03,45.5
  Bottom 0.45: U$106.1 85.22,29.22 v87,31 87.28,30.72 U$106.3 U$106.2
  Bottom 0.508: C18.1 12.7,10.74 U$13.5 | C27.1 38.75,17.6 R16.1 | C28.1 R18.1 | C26.1 R13.1 | U$107.3 U$107.2 U$107.1 | 80,30.5 v80.5,31 80,30.5
  Bottom 1.016: U$13.5 14.74,9.5 v15.5,9.5 | U$107.2 80.01,27.01 v80,27 80,30.5
  Bottom 1.93: C15.- C30.-
  other vias: 83,34.5 84.5,34.5 88.5,33.5 92.5,33.5 37,9.5 38,9.5 25.5,9.5 26.5,9.5 48.5,9.5 49.5,9.5 71.5,83 71.5,84.5 71.5,81.5 71.5,80 71.5,78.5 71.5,77 70.5,75.5 69.5,74.5 71.5,71.5 71.5,70 71.5,68.5 72.5,72.5 73.5,73.5 68.5,63.5 68.5,62 68.5,60.5 68.5,59 68.5,65 68.5,66.5 68.5,57.5 68.5,56 68.5,54.5 68.5,53 68.5,51.5 59,68.5 59,70 59,71.5 59,73 47.5,68.5 47.5,70 47.5,71.5 47.5,73 35.5,68.5 35.5,70 35.5,71.5 35.5,73 24,68.5 24,70 24,71.5 24,73 85,68.5 85,70 85,71.5 85,73 98,68.5 98,70 98,71.5 98,73 96,43.5 96,42 96,40.5 96,39 96,37.5 96,36 96,34.5 96,33 96,31.5 96,30 96,28.5 91.5,9.5 86,9.5 97,9.5 98.5,9.5 100,9.5 84.5,9.5 83,9.5 81.5,9.5 69,2 70.5,2 63,2 76.5,2 87.5,38.5 88.59,37.42 81.26,37.8 77.36,37.41 74.86,30.41 74.86,35.91 74.86,37.41 86.5,37 91.5,24 75.5,24.5 76.5,24.5 72,28.5 73.5,28.5 76.5,17.5 76.5,15.5 76.5,13.5 52.5,12 41,12 29.5,12 17.5,12 14.5,9.5 62,17.5 59.5,12.5 59.5,11 61,11 61,12.5 62.5,12.5 62.5,11 64,11 64,12.5 64,15.5 64,18.5 64,22 64,26 64,36.5 62.5,36.5 61,36.5 59.5,36.5 58,36.5 44.5,56.5 44.5,55 44.5,53.5 43.5,52.5 16,52.5 17.5,52.5 19,52.5 20.5,52.5 22,52.5 23.5,52.5 25,52.5 24,74.5 24,76 24,77.5 24,79 24,80.5 24,82 24,83.5 24,85 35.5,74.5 35.5,76 35.5,77.5 47.5,74.5 47.5,76 47.5,77.5 59,74.5 59,76 59,77.5 85,74.5 85,76 85,77.5 98,74.5 98,76 98,77.5 59.5,9.5 61,9.5 62.5,9.5 64,9.5 29.5,52.5 31,52.5 32.5,52.5 34,52.5 35.5,52.5 37,52.5 17.5,34 20.5,30.5
  pour Top: 0,86.5 102,86.5 102,0 59,0 59,9.5 16.5,9.5 16,72.5 0,72.5
  pour Route2: 10.5,0 102,0 102,86.5 10.5,86.5
  pour Route15: 16,13 16,10 59,9 59,0.5 101.5,0.5 101.5,13
  pour Bottom: 39,8.5 39,11 35.5,11 35.5,8.5
  pour Bottom: 27.5,8.5 27.5,11 24,11 24,8.5
  pour Bottom: 45,52 45,57 24.5,60 24.5,85.5 32,85.5 32,75.5 35,72.5 35,68 36,68 36,85.5 43.5,85.5 43.5,75.5 46.5,72.5 46.5,68 48,68 48,85.5 55.5,85.5 55.5,75.5 58.5,72.5 58.5,68 59.5,68 59.5,85.5 67,85.5 67,75.5 70,72.5 70,68 75.5,68 75.5,85.5 84.5,85.5 84.5,68 88.5,68 88.5,85.5 97.5,85.5 97.5,48.5 95.5,48.5 95.5,10.5 59,10.5 59,0 102,0 102,86.5 0,86.5 0,72 15.5,72 15.5,52
  pour Bottom: 50.5,8.5 50.5,11 47,11 47,8.5
  pour Route15: 0,86.5 102,86.5 102,15 84,15 84,26.5 73.5,26.5 68.5,21.5 16,21.5 16,72.5 0,72.5
IBAT0_AD  (via drill 0.3 pad 0.6)
  Route2 0.508: X2.19 16.5,18.5 16.5,14 15.5,13 v13.5,13
  Bottom 0.3: U$13.7 13.5,13.28 v13.5,13
IBAT1_AD  (via drill 0.3 pad 0.6)
  Route2 0.508: X2.21 24.5,15.5 arc85 v25.5,13
  Bottom 0.3: U$11.7 25.5,13.28 v25.5,13
IBAT2_AD  (via drill 0.3 pad 0.6)
  Route2 0.508: X2.23 v37,13
  Bottom 0.3: U$8.7 37,13.23 v37,13
IBAT3_AD  (via drill 0.3 pad 0.6)
  Route2 0.508: X2.25 v48.5,13
  Bottom 0.3: U$4.7 48.5,13.27 v48.5,13
IMON1  (via drill 0.3 pad 0.6)
  Top 0.152: v84.47,37.99 U$17.P$11
  Route15 0.152: X2.27 50.25,33.82 85.83,33.82 86.72,34.71 87.35,34.71 87.7,35.05 87.7,35.47 86.7,36.47 85.99,36.47 v84.47,37.99
IMON2
  Top 0.152: U$17.P$14 82.97,37.72 82.06,38.63 82.06,42.09 81.57,42.57 69.13,42.57 68.22,43.48 46.13,43.48 X2.29
LBI0
  Top 0.3: C40.1 arc-90 25,16.15 25,16.32
  Top 0.508: U$20.4 25,16.32 25.15,16.32 25.15,17 | 25.15,17 R13.2 | R13.2 R11.1 | R13.2 25.15,17
LBI1
  Top 0.3: C41.1 arc-90 37,16.15 37,16.32
  Top 0.508: U$22.4 37,16.32 37.15,16.32 37.15,17 | 37.15,17 R16.2 | R16.2 R15.1 | R16.2 37.15,17
LBI2
  Top 0.3: C42.1 48.65,16.32
  Top 0.508: U$21.4 48.65,16.32 48.65,17 | 48.65,17 R18.2 | R18.2 R17.1 | R18.2 48.65,17
LBI3
  Top 0.3: C43.1 arc-90 60,16.15 60,16.32
  Top 0.508: U$23.4 60,16.32 60.15,16.32 60.15,16.5 | 60.15,16.5 R20.2 | R20.2 R19.1 | R20.2 60.15,16.5
N$1
  Top 1.016: R6.2 28.04,76.1 LED1.C
N$3
  Bottom 0.152: BAT0.1 20.19,5.68 20,5.87 F3.2
N$4
  Top 1.016: R7.2 39.73,76.07 39.76,76.09 LED2.C
N$5
  Top 0.152: U$17.P$9 85.47,37.72 85.71,37.72 85.87,37.56 87.5,37.56 87.65,37.41 | R4.2 88.69,38.44 87.65,37.41 | R21.1 88.69,36.37 87.65,37.41
N$7
  Top 1.016: R8.2 51.46,76.07 | 51.46,76.07 | 51.46,76.07 LED3.C
N$8
  Bottom 0.152: F6.2 55.1,5.87 55.14,5.83 BAT3.1
N$9
  Top 1.016: R9.2 63.2,76.03 63.19,76.05 LED4.C
N$10
  Bottom 0.152: F4.2 32,5.87 31.84,5.71 BAT1.1
N$11
  Bottom 0.508: C4.2 U$8.6
N$12
  Bottom 0.152: F5.2 43.5,5.87 43.48,5.85 BAT2.1
N$14
  Bottom 0.508: C11.2 U$11.6
N$15
  Top 1.016: R1.2 81.75,76.07 81.68,76.14 LED5.C
N$17
  Top 1.016: R2.2 93.47,76.11 93.48,76.11 LED6.C
N$18
  Top 0.152: U$17.P$16 79.56,37.09 79.15,36.68 | R5.2 78.14,37.68 79.15,36.68 | R40.1 78.85,36.38 79.15,36.68
N$19
  Top 0.254: PWRLED.A R12.1
N$21
  Bottom 0.508: C7.2 49.96,11.99 U$4.6
N$24  (via drill 0.3 pad 0.6)
  Top 0.152: R3.2 87.32,26.48 87.32,26.74 v87.56,26.97 | U$17.P$3 86.67,33.84 86.89,33.62 87.43,33.62 v87.54,33.51
  Route2 0.152: v87.56,26.97 87.56,33.49 v87.54,33.51
N$27
  Bottom 0.508: C18.2 14.74,11.96 U$13.6
N$29
  Top 0.152: U$17.P$31 84.97,31.46 84.99,31.46 85.34,31.1 85.34,29.76 84.5,28.91 84.5,28.89 84.63,28.76 84.95,28.76 85.12,28.93 85.17,28.93 C8.1
N$30
  Top 0.152: U$17.P$26 82.47,31.46 82.38,31.37 82.38,29.08 82.25,28.94 C21.1
OUT1_EN  (via drill 0.3 pad 0.6)
  Route15 0.508: X2.18 31.29,46.41 63.5,46.41 v67,42.91
  Bottom 0.45: 66.83,43.29 U$24.2
  Bottom 0.508: 65.95,42.93 65.93,42.95 | R26.2 65.95,42.93 | v67,42.91 66.72,43.19 | 66.83,43.29 66.72,43.19 | 66.72,43.19 66.46,42.93 65.95,42.93
OUT1_G  (via drill 0.3 pad 0.6)
  Top 0.508: v66.5,47.59 64.34,49.75 v64.34,50
  Bottom 0.45: U$24.6 66.17,47.67 66.47,47.67 66.5,47.64
  Bottom 0.508: v64.34,50 63.83,50 U$1.P$4 63.41,51.49 63.83,51.92 63.96,51.92 C24.2 | 66.5,47.64 v66.5,47.59
OUT1_S
  Bottom 0.45: 66.83,49.96 U$24.7
  pour Bottom: 25.5,67 68,67 68,49.5 46,49.5 46,58 25.5,61
OUT2_EN  (via drill 0.3 pad 0.6)
  Top 0.508: v77.39,45.96 33.38,45.96 X2.20
  Bottom 0.45: 77.83,43.29 U$25.2 77.83,45.77
  Bottom 0.508: R24.2 77.83,42.38 77.83,43.29 | v77.39,45.96 77.58,45.77 77.83,45.77
OUT2_G
  Bottom 0.45: 77.17,49.71 U$25.6
  Bottom 0.508: U$14.P$4 74.16,51.49 74.66,51.49 74.87,51.69 | C22.2 74.87,51.69 | 77.17,49.71 75.19,51.69 74.87,51.69
OUT2_S
  Bottom 0.45: U$25.7 77.83,48.68 77.83,50.58
  pour Bottom: 69,67 80.5,67 80.5,49.5 69,49.5
OUT3_EN  (via drill 0.3 pad 0.6)
  Top 0.508: 89.09,42.37 v89.58,42.37
  Route15 0.508: X2.22 35.66,45.7 63.17,45.7 66.69,42.18 89.39,42.18 v89.58,42.37
  Bottom 0.284: U$26.2 89.33,42.37 v89.58,42.37
  Bottom 0.508: R22.2 89.56,42.35 v89.58,42.37
OUT3_G  (via drill 0.3 pad 0.6)
  Route2 0.508: v86.81,50.42 86.81,49.84 v89.09,47.56
  Bottom 0.45: 89.01,47.64 88.7,47.64 88.67,47.67 U$26.6
  Bottom 0.508: 89.01,47.64 v89.09,47.56 | v86.81,50.42 U$15.P$4 85.91,51.49 85.94,51.52 86.26,51.52 C23.2
OUT3_S
  Bottom 0.45: 89.33,49.96 U$26.7
  pour Bottom: 81.5,49.5 96.5,49.5 96.5,67 81.5,67
OUT4_EN  (via drill 0.3 pad 0.6)
  Top 0.152: U$17.P$4 86.92,34.34 v87.11,34.15
  Route15 0.152: X2.24 38.16,43.37 39.62,43.37 40.84,42.14 40.84,41.78 49.12,33.51 86.47,33.51 v87.11,34.15
OUT5_EN  (via drill 0.3 pad 0.6)
  Top 0.152: U$17.P$21 80.02,34.34 v80,34.35
  Route15 0.152: v80,34.35 | v80,34.35 50.86,34.35 43.37,41.85 43.37,42.13 42.27,43.23 40.84,43.23 X2.26
PGOOD1  (via drill 0.3 pad 0.6)
  Top 0.152: R10.2 67.9,38.29 55.05,38.29 50.39,42.95 48.15,42.95 X2.31 | U$17.P$5 86.85,34.84 86.85,35 v87.13,35.28
  Route15 0.152: v87.13,35.28 82.51,35.28 76.43,41.37 61.49,41.37 59.88,42.97 48.17,42.97 X2.31
PGOOD2  (via drill 0.3 pad 0.6)
  Top 0.152: U$17.P$20 80.59,34.84 v80.36,35.08 | X2.33 54.13,37.56 R14.2
  Route15 0.152: X2.33 56.62,35.08 v80.36,35.08
PWM_A
  Route2 0.508: X3.3 73.5,14.5 53.5,34.5 53.5,40.73 X2.34
PWM_B
  Route2 0.508: X4.3 66,18.5 50,34.5 48.5,36 48.5,43.19 X2.32
PWR1
  Top 1.016: M1.1 28.06,78.92 28.04,78.9 LED1.A
  pour Bottom: 25.5,84.5 31,84.5 31,75 34,72 34,68 25.5,68
PWR2
  Top 1.016: M2.1 39.76,78.92 39.76,78.91 LED2.A
  pour Bottom: 37,84.5 42.5,84.5 42.5,75 45.5,72 45.5,68 37,68
PWR3
  Top 1.016: M3.1 51.46,78.92 LED3.A
  pour Bottom: 49,84.5 54.5,84.5 54.5,75 57.5,72 57.5,68 49,68
PWR4
  Top 1.016: M4.1 63.16,78.92 63.17,78.91 63.19,78.91 LED4.A
  pour Bottom: 60.5,84.5 66,84.5 66,75 69,72 69,68 60.5,68
PWR5
  Top 1.016: PC.1 81.71,78.97 81.68,78.94 LED5.A
  pour Bottom: 83.5,84.5 76.5,84.5 76.5,68 83.5,68
PWR6
  Top 1.016: MISC.1 93.46,78.97 93.48,78.95 LED6.A
  pour Bottom: 96.5,84.5 89.5,84.5 89.5,68 96.5,68
SERVO  (via drill 0.6 pad 0.6)
  Top 0.61: 69.81,10.2 69.81,9.69 v70.2,8.8 | v70.2,10.3 70.2,10.41 70.07,10.28 | v70.2,11.8 v70.2,13.3 70.2,13.33 70.44,13.56 | 70.44,13.56 70.49,13.61 70.44,13.56 | 71.98,14.59 71.91,14.59 v71.7,14.8
  Top 1.016: L2.2 71.98,14.59 68.54,18.02 68.54,24.14 70.5,26.09 C2.+ 74.58,26.09 75.59,27.09 75.59,27.45 C104.1 76.77,28.69 76.76,28.7 SJ100.2 | 69.81,10.2 70.07,10.28 71.98,10.87 L2.2 | v70.2,13.3 70.25,13.25 L2.2
  Top 3: X3.2 69.81,4.5 69.81,10.2
  Route15 2.54: X4.2 X3.2
  Bottom 0.61: 70.31,13.59 70.41,13.59 70.44,13.56 | v71.7,14.8 71.7,14.87 71.53,15.04
  Bottom 1.016: 70.31,13.59 71.2,13.7 | 71.2,13.7 C15.+ | C30.+ 70.39,14.52 71.2,13.7 | v70.2,11.8 70.25,11.75 70.31,11.75
  Bottom 2.54: 70.31,13.59 70.31,11.75 70.31,4.5 X3.2 76.5,4.5 79.5,7.5 83.09,7.5 X1.3
SW1
  Top 0.152: SJ108.1 88.67,28.07 88.69,28.09 R31.2 86.87,28.81 | 86.87,28.81 C8.2 | U$17.P$32 85.47,31.46 86.87,30.06 86.87,28.81
SW2
  Top 0.152: U$17.P$25 81.97,30.37 80.55,28.94 C21.2 78.84,28.21 | 78.84,28.21 R32.2 | SJ110.1 78.84,28.21
V+  (via drill 0.6 pad 0.6, 0.8 pad 0.6, 0.9 pad 0.6)
  Top 0.254: R12.2 78.59,8.67 78.94,8.67 81.34,11.07 C3.+
  Top 0.45: C44.+ v40.5,27
  Top 0.61: C44.+ v40.5,27
  Top 1.016: C3.+ | 80.87,15.98 80.87,19.45 C32.1 83.96,19.45 C29.2 | v67.6,47.21 67.92,47.21 70.56,49.85 C14.+
  Top 2.54: 80.87,12.9 v78.72,12.9 | 80.87,12.9 81.15,12.62 C3.+ | 80.87,15.98 80.87,12.9 | C39.+ 59.28,41.38 v59.44,41.54 | C13.+ v79.23,49.85 C14.+ | C38.+ 93.5,45.75 v93.5,46.5 94.5,46.5 C45.+
  Bottom 0.45: 90.24,48.67 U$26.8 | 79.02,49.22 U$25.8 | U$24.8 67.47,48.49
  Bottom 0.61: U$5.P$7 20.68,29.18 21.5,30 22,29.5 21.95,29.45 U$5.P$8
  Bottom 1.016: 90.24,48.67 91.63,47.28 | 79.23,49.43 v79.23,49.85
  pour Bottom: 15.5,26 62,26 62,11.5 94.5,11.5 94.5,48.5 45,48.5 45,51 15.5,51
VBAT0
  pour Bottom: 17,12.5 17,8.5 23,8.5 23,12.5
VBAT0_X  (via drill 0.3 pad 0.6)
  Top 0.45: R27.2 R30.2
  Top 0.508: U$20.8 20,20.68 PAD1.1 20,16.35 R30.2 | v27,19 R11.2 v27,19
  Top 2.095: PAD8.1 9.04,29.46 PAD1.1
  Route2 1.016: PAD8.1 9.04,41.94 X2.1 X2.2
  Bottom 0.508: 20.5,19 PAD1.1 18.14,16.64 U$12.P$8
  Bottom 1.016: v27,19 20.5,19
  pour Bottom: 17,17.5 23,17.5 23,13 17,13
VBAT1
  pour Bottom: 29,12.5 29,8.5 35,8.5 35,12.5
VBAT1_X  (via drill 0.3 pad 0.6)
  Top 0.45: R34.2 R37.2
  Top 0.508: U$22.8 32,20.68 PAD2.1 32,16.35 R37.2 | R15.2 v39,19
  Top 2.095: PAD7.1 11.64,30.86 17,25.5 25,25.5 PAD2.1
  Route2 1.016: PAD7.1 11.62,37.81 X2.3 X2.4
  Bottom 0.508: 32.5,19 PAD2.1 30.09,16.59 U$10.P$8
  Bottom 1.016: v39,19 32.5,19
  pour Bottom: 29,17.5 35,17.5 35,13 29,13
VBAT2
  pour Bottom: 40.5,12.5 40.5,8.5 46.5,8.5 46.5,12.5
VBAT2_X  (via drill 0.3 pad 0.6)
  Top 0.45: R38.2 R43.2
  Top 0.508: U$21.8 43.5,20.68 PAD3.1 43.5,16.35 R43.2
  Top 1.016: v50.5,19 R17.2
  Top 2.095: PAD6.1 14.15,33.85 20,28 34,28 PAD3.1
  Route2 1.016: PAD6.1 X2.5 X2.6
  Bottom 0.508: 44,19 PAD3.1 41.65,16.65 U$7.P$8 | v50.5,19 R17.2 v50.5,19
  Bottom 1.016: R17.2 44,19
  pour Bottom: 40.5,17.5 46.5,17.5 46.5,13 40.5,13
VBAT3
  pour Bottom: 52,12.5 52,8.5 58,8.5 58,12.5
VBAT3_X  (via drill 0.3 pad 0.6)
  Top 0.45: R44.2 R47.2
  Top 0.508: U$23.8 55,20.68 PAD4.1 55,16.35 R47.2
  Top 1.016: v62,19 R19.2
  Top 2.095: PAD5.1 23.47,31 42,31 47.5,24 49.5,24 53.5,20 PAD4.1
  Route2 1.016: PAD5.1 X2.7 X2.8
  Bottom 0.508: 55.5,19 PAD4.1 53.12,16.62 U$3.P$8 | v62,19 R19.2 v62,19
  Bottom 1.016: R19.2 55.5,19
  pour Bottom: 52,17.5 58,17.5 58,13 52,13
VIN  (via drill 0.3 pad 0.6)
  Top 0.152: U$17.P$23 80.59,33.34 80.59,32.79 v80.34,32.53
  Bottom 0.152: SJ104.1 79.9,32.97 v80.34,32.53
VREF2
  Top 0.152: 83.47,36.46 84.67,36.46 85.59,35.54 85.59,35.34 U$17.P$6 | 83.47,36.46 U$17.P$13 83.47,37.72 83.4,37.72 83.03,38.09 R39.1 83.05,39.34 | U$17.P$19 81.85,35.34 81.85,35.55 82.75,36.46 83.47,36.46 | 83.7,41.53 83.64,41.6 C10.1 | 83.7,41.53 83.68,41.51 C33.2 83.05,39.34 | C34.2 83.7,41.53 | R23.2 83.05,39.34
VREG3
  Top 0.152: 71.14,33.56 71.14,29.79 71.29,29.64 79.4,29.64 79.71,29.94 79.71,32.95 80.59,33.84 U$17.P$22 | 71.14,33.56 70.98,33.56 68.68,35.86 R10.1 R14.1 | C17.2 72.71,33.56 71.14,33.56
X1  (via drill 0.8 pad 0.6)
  Top 1.016: SJ108.2 88.67,24.58 89.07,24.58 v91.33,22.32 91.44,22.32 91.89,21.87 L1.2
  Bottom 0.508: U$105.2 86.16,21.22 86.27,21.11
  Bottom 1.016: 86.27,22.62 86.27,21.11 87.95,19.43 89.14,19.43 91.33,21.61 v91.33,22.32
  pour Bottom: 84.65,24.12 84.65,21.12 88.65,21.12 88.65,24.12
X2  (via drill 0.8 pad 0.6)
  Top 1.016: L2.1 75.42,21.93 76.11,22.62 v77.98,22.62 78.84,23.49 SJ110.2
  Bottom 0.508: U$107.8 78.74,22.87 79,22.62
  Bottom 1.016: 80.21,22.62 79,22.62 v77.98,22.62
  pour Bottom: 78.65,24.12 78.65,21.12 82.65,21.12 82.65,24.12

## Text on the board
tPlace: R | L